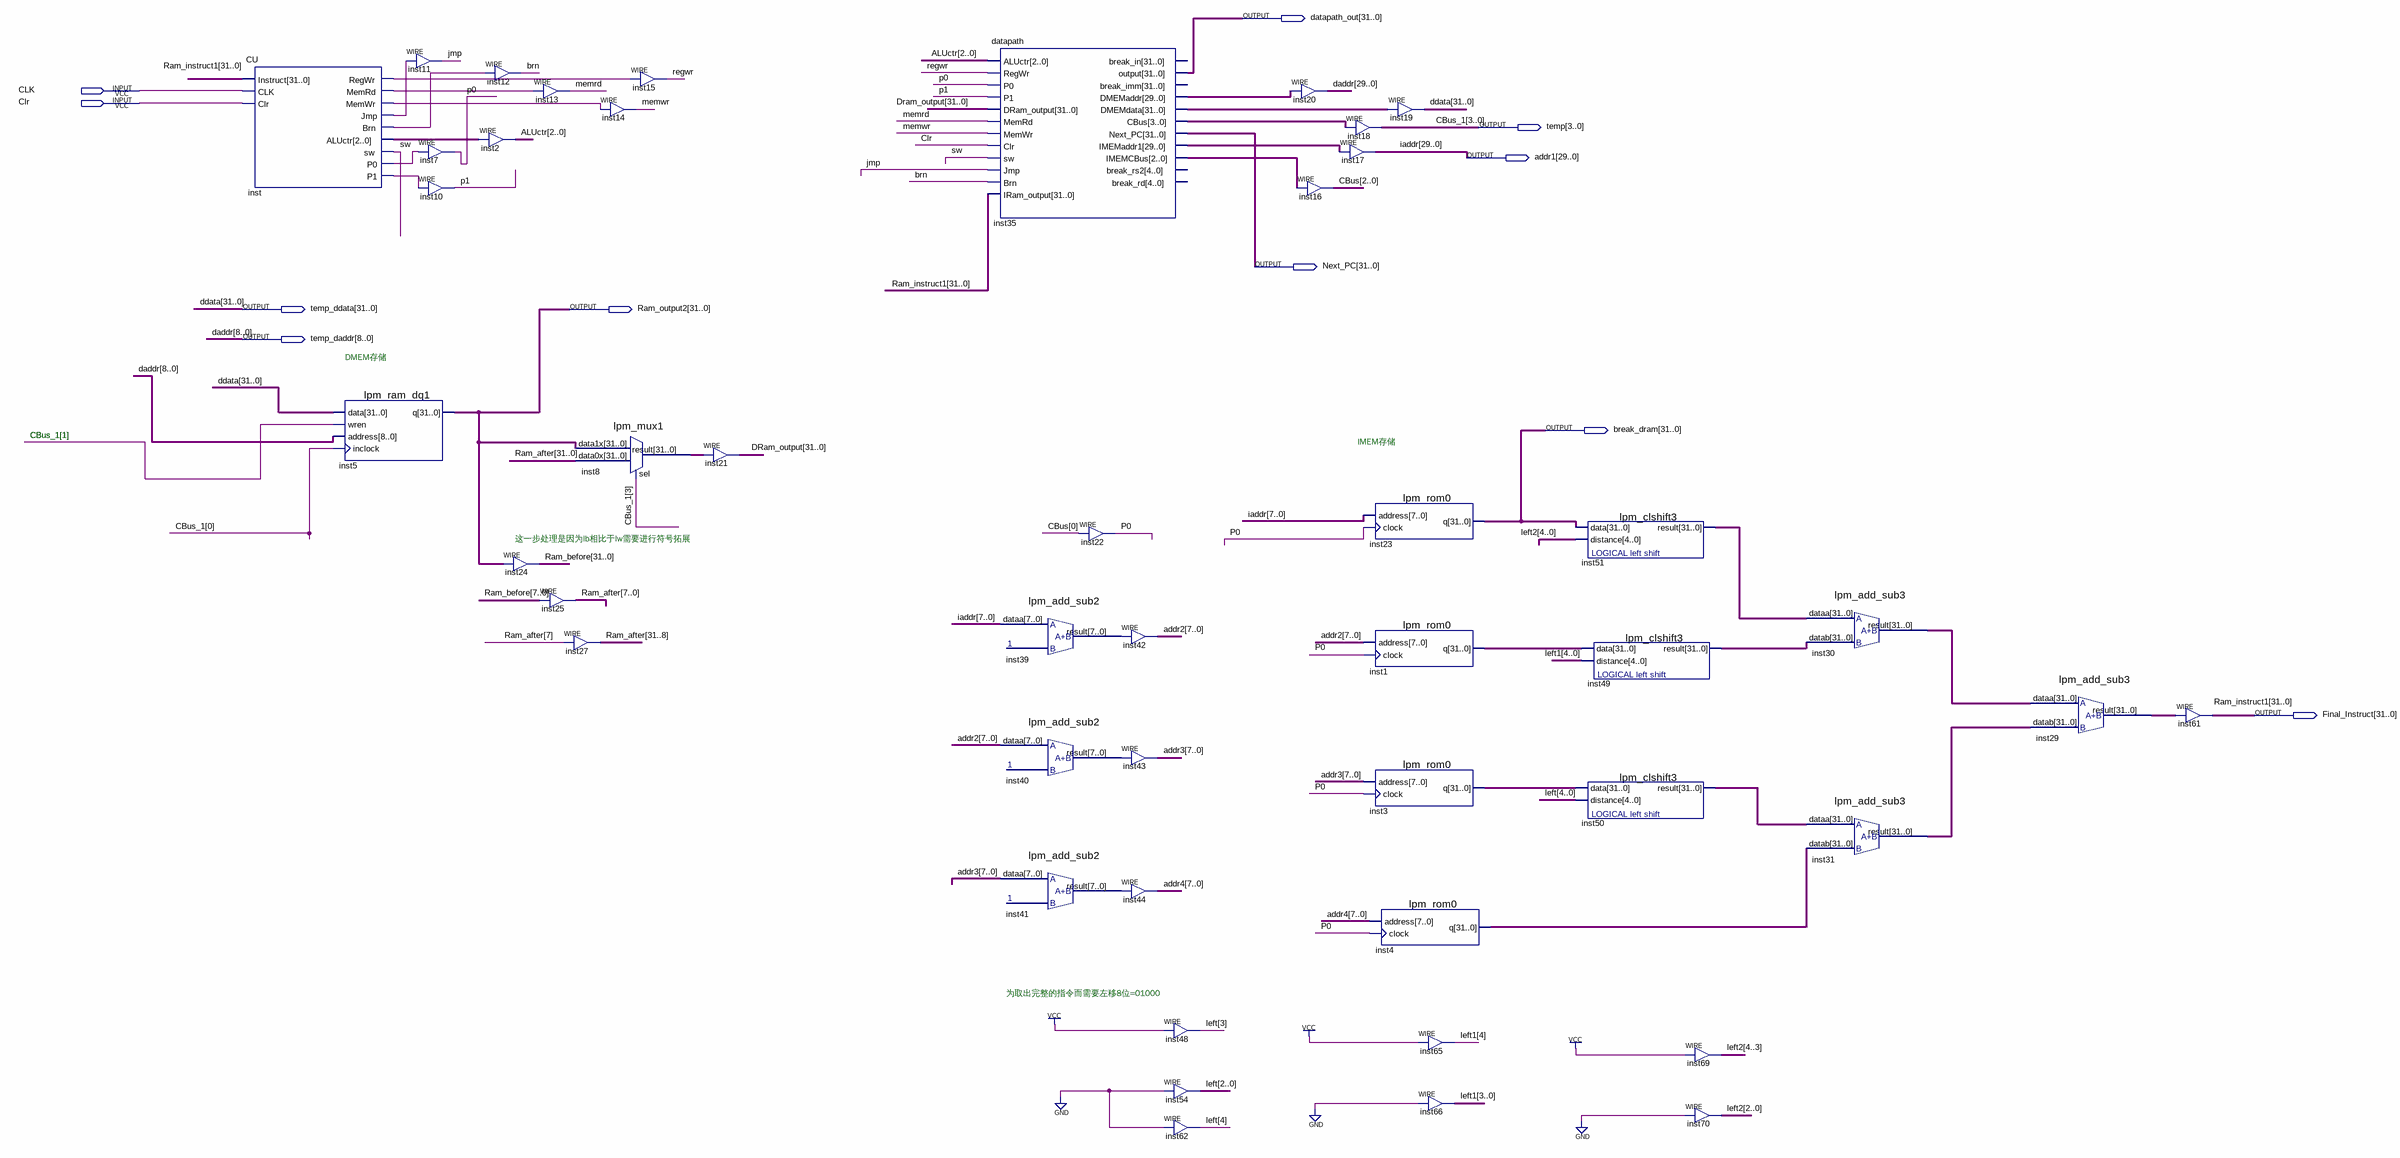
[diagram p0: schematic sheet]
// Quartus schematic host.bdf as structural Verilog: 46 symbols, 11 pins
module host (
  input  CLK,
  input  Clr,
  output [31:0] datapath_out,
  output [3:0] temp,
  output [29:0] addr1,
  output [31:0] Next_PC,
  output [31:0] temp_ddata,
  output [31:0] Ram_output2,
  output [8:0] temp_daddr,
  output [31:0] break_dram,
  output [31:0] Final_Instruct
);

  wire brn, inst_brn, inst_jmp, inst_memrd, inst_memwr, inst_p0, inst_p1, inst_regwr, jmp, memrd, memwr, p0,
       p1, regwr, sw;
  wire [2:0] ALUctr, CBus, inst35_imemcbus, inst_aluctr;
  wire [3:0] inst35_cbus;
  wire [4:0] left, left1, left2;
  wire [7:0] addr2, addr3, addr4, inst39_result, inst40_result, inst41_result;
  wire [29:0] inst35_dmemaddr, inst35_imemaddr1;
  wire [29:9] daddr;
  wire [31:0] Dram_output, inst1_q, inst3_q, inst4_q, inst8_result, inst29_result, inst30_result,
       inst31_result, inst35_dmemdata, inst49_result, inst50_result, inst51_result, Ram_after, Ram_before;

  CU inst (
    .Instruct(Final_Instruct), .CLK(CLK), .Clr(Clr), .RegWr(inst_regwr), .MemRd(inst_memrd),
    .MemWr(inst_memwr), .Jmp(inst_jmp), .Brn(inst_brn), .ALUctr(inst_aluctr), .sw(sw), .P0(inst_p0),
    .P1(inst_p1));
  lpm_ram_dq1 inst5 (.data(temp_ddata), .wren(temp[1]), .address(temp_daddr), .inclock(temp[0]), .q(Ram_output2));
  assign jmp = inst_jmp;  // WIRE inst11
  assign p0 = inst_p0;  // WIRE inst7
  assign p1 = inst_p1;  // WIRE inst10
  assign brn = inst_brn;  // WIRE inst12
  assign ALUctr = inst_aluctr;  // WIRE inst2
  assign Ram_before = Ram_output2;  // WIRE inst24
  assign memrd = inst_memrd;  // WIRE inst13
  assign Ram_after[7:0] = Ram_before[7:0];  // WIRE inst25
  assign Ram_after[31:8] = {24{Ram_after[7]}};  // WIRE inst27
  assign memwr = inst_memwr;  // WIRE inst14
  lpm_mux1 inst8 (.data1x(Ram_output2), .data0x(Ram_after), .sel(temp[3]), .result(inst8_result));
  assign regwr = inst_regwr;  // WIRE inst15
  assign Dram_output = inst8_result;  // WIRE inst21
  datapath inst35 (
    .ALUctr(ALUctr), .RegWr(regwr), .P0(p0), .P1(p1), .DRam_output(Dram_output), .MemRd(memrd),
    .MemWr(memwr), .Clr(Clr), .sw(sw), .Jmp(jmp), .Brn(brn), .IRam_output(Final_Instruct),
    .\output (datapath_out), .DMEMaddr(inst35_dmemaddr), .DMEMdata(inst35_dmemdata), .CBus(inst35_cbus),
    .Next_PC(Next_PC), .IMEMaddr1(inst35_imemaddr1), .IMEMCBus(inst35_imemcbus));  // open: break_in, break_imm, break_rs2, break_rd
  lpm_add_sub2 inst39 (.dataa(addr1[7:0]), .result(inst39_result));
  lpm_add_sub2 inst40 (.dataa(addr2), .result(inst40_result));
  lpm_add_sub2 inst41 (.dataa(addr3), .result(inst41_result));
  assign p0 = CBus[0];  // WIRE inst22
  assign addr2 = inst39_result;  // WIRE inst42
  assign addr3 = inst40_result;  // WIRE inst43
  assign addr4 = inst41_result;  // WIRE inst44
  assign left[3] = 1'b1;  // WIRE inst48
  assign left[2:0] = 3'b000;  // WIRE inst54
  assign left[4] = 1'b0;  // WIRE inst62
  assign {daddr, temp_daddr} = inst35_dmemaddr;  // WIRE inst20
  assign addr1 = inst35_imemaddr1;  // WIRE inst17
  assign CBus = inst35_imemcbus;  // WIRE inst16
  assign temp_ddata = inst35_dmemdata;  // WIRE inst19
  assign temp = inst35_cbus;  // WIRE inst18
  lpm_rom0 inst23 (.address(addr1[7:0]), .clock(p0), .q(break_dram));
  lpm_rom0 inst1 (.address(addr2), .clock(p0), .q(inst1_q));
  lpm_rom0 inst3 (.address(addr3), .clock(p0), .q(inst3_q));
  lpm_rom0 inst4 (.address(addr4), .clock(p0), .q(inst4_q));
  assign left1[4] = 1'b1;  // WIRE inst65
  assign left1[3:0] = 4'b0000;  // WIRE inst66
  lpm_clshift3 inst51 (.data(break_dram), .distance(left2), .result(inst51_result));
  lpm_clshift3 inst49 (.data(inst1_q), .distance(left1), .result(inst49_result));
  lpm_clshift3 inst50 (.data(inst3_q), .distance(left), .result(inst50_result));
  assign left2[4:3] = 2'b11;  // WIRE inst69
  assign left2[2:0] = 3'b000;  // WIRE inst70
  lpm_add_sub3 inst30 (.dataa(inst51_result), .datab(inst49_result), .result(inst30_result));
  lpm_add_sub3 inst31 (.dataa(inst50_result), .datab(inst4_q), .result(inst31_result));
  lpm_add_sub3 inst29 (.dataa(inst30_result), .datab(inst31_result), .result(inst29_result));
  assign Final_Instruct = inst29_result;  // WIRE inst61

  // Other names for the same wires on the sheet: iaddr[29:0] = addr1; CBus_1[3:0] = temp; daddr[8:0] = temp_daddr;
  //   ddata[31:0] = temp_ddata; Ram_instruct1[31:0] = Final_Instruct

  // Notes on the sheet:
  //   DMEM存储
  //   CBus_1[1]
  //   IMEM存储
  //   这一步处理是因为lb相比于lw需要进行符号拓展
  //   为取出完整的指令而需要左移8位=01000
endmodule
